# EAGLE schematic UNO florist automata V1.0 (EAGLE 9.1.3)
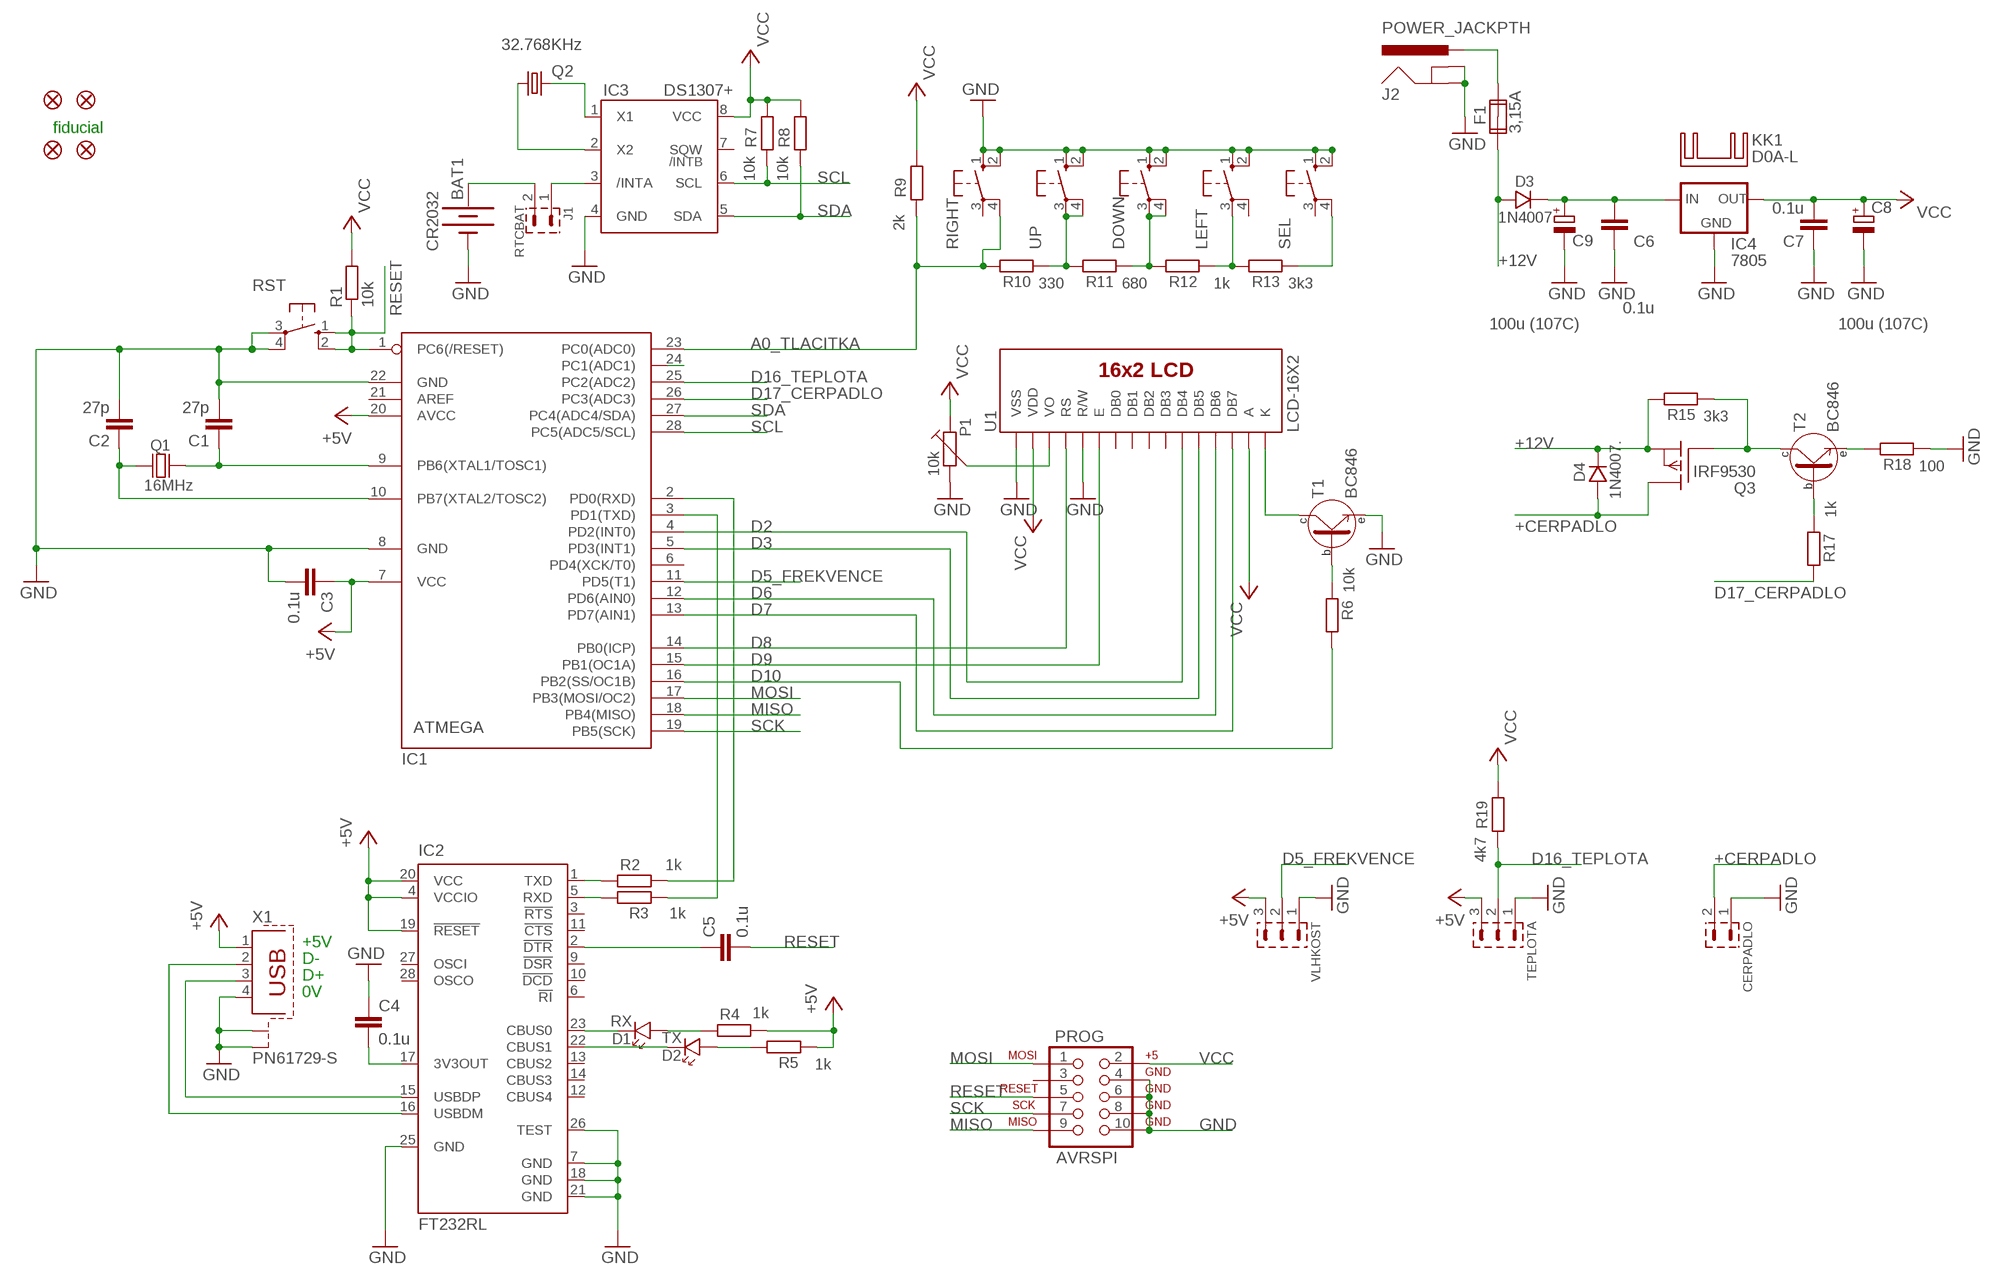
[diagram p0: schematic, sheet 1]

## Parts
BAT1  CR2032  BATTERY20PTH  [BATTCOM_20MM_PTH]
C1  27p  C-EUC1206  [C1206]
C2  27p  C-EUC1206  [C1206]
C3  0.1u  C-EUC1206  [C1206]
C4  0.1u  C-EUC1206  [C1206]
C5  0.1u  C-EUC1206  [C1206]
C6  0.1u  C-EUC1206  [C1206]
C7  0.1u  C-EUC1206  [C1206]
C8  100u (107C)  CPOL-EUC/6032-28W  [C/6032-28W]
C9  100u (107C)  CPOL-EUC/6032-28W  [C/6032-28W]
CERPADLO  PSH02-02P  [PSH02-02P]
D1  RX  LED_1206  [P1206]
D2  TX  LED_1206  [P1206]
D3  1N4007.  [SM-1]
D4  1N4007.  [SM-1]
DOWN  10-XX  [B3F-10XX]
F1  3,15A  FUSE2P  [FUSE1]
FID1  FIDUCIAL1.5X3  [FIDUCIAL-1.5X3]
FID2  FIDUCIAL1.5X3  [FIDUCIAL-1.5X3]
FID3  FIDUCIAL1.5X3  [FIDUCIAL-1.5X3]
FID4  FIDUCIAL1.5X3  [FIDUCIAL-1.5X3]
IC1  ATMEGA  MEGA8-P  [DIL28-3]
IC2  FT232RL  [SSOP28]
IC3  DS1307+  DS1337S+  [SO08]
IC4  7805  78XXL  [78XXL]
J1  RTCBAT  S1G2_JUMP  [S1G2_JUM]
J2  POWER_JACKPTH  [POWER_JACK_PTH]
KK1  D0A-L  [D02A-L]
LEFT  10-XX  [B3F-10XX]
P1  10k  TRIMRPT10V  [PT10V]
PROG  AVRSPI  AVR_SPI_PROG2LOCK  [2X5-SHROUDED_LOCK]
Q1  16MHz  Q_HC-49U  [HC-49U]
Q2  32.768KHz  CRYSTALTC38H  [TC38H]
Q3  IRF9530  [TO220]
R1  10k  R-EU_M1206  [M1206]
R2  1k  R-EU_M1206  [M1206]
R3  1k  R-EU_M1206  [M1206]
R4  1k  R-EU_M1206  [M1206]
R5  1k  R-EU_M1206  [M1206]
R6  10k  R-EU_M1206  [M1206]
R7  10k  R-EU_M1206  [M1206]
R8  10k  R-EU_M1206  [M1206]
R9  2k  R-EU_M1206  [M1206]
R10  330  R-EU_M1206  [M1206]
R11  680  R-EU_M1206  [M1206]
R12  1k  R-EU_M1206  [M1206]
R13  3k3  R-EU_M1206  [M1206]
R15  3k3  R-EU_M1206  [M1206]
R17  1k  R-EU_M1206  [M1206]
R18  100  R-EU_M1206  [M1206]
R19  4k7  R-EU_M1206  [M1206]
RIGHT  10-XX  [B3F-10XX]
RST  10-XX  [B3F-10XX]
SEL  10-XX  [B3F-10XX]
T1  BC846  [SOT-23]
T2  BC846  [SOT-23]
TEPLOTA  PSH02-03P  [PSH02-03P]
U1  LCD-16X2  LCD-16X2NOSILK  [LCD-16X2_NOSILK]
UP  10-XX  [B3F-10XX]
VLHKOST  PSH02-03P  [PSH02-03P]
X1  PN61729-S  [PN61729-S]

## Nets
+12V: D3.A D4.K F1.1A Q3.3(S) R15.2
+CERPADLO: CERPADLO.2 D4.A Q3.2(D)
A: IC3.2(X2) Q2.1
A0_TLACITKA: IC1.23(PC0(ADC0)) R9.1 R10.2 RIGHT.4(P1)
A1_OSVETLENI: IC1.24(PC1(ADC1))
D2: IC1.4(PD2(INT0)) U1.11(DB4)
D3: IC1.5(PD3(INT1)) U1.12(DB5)
D5_FREKVENCE: IC1.11(PD5(T1)) VLHKOST.2
D6: IC1.12(PD6(AIN0)) U1.13(DB6)
D7: IC1.13(PD7(AIN1)) U1.14(DB7)
D8: IC1.14(PB0(ICP)) U1.4(RS)
D9: IC1.15(PB1(OC1A)) U1.6(E)
D10: IC1.16(PB2(SS/OC1B)) R6.2
D16_TEPLOTA: IC1.25(PC2(ADC2)) R19.1 TEPLOTA.2
D17_CERPADLO: IC1.26(PC3(ADC3)) R17.2
GND: BAT1.2(-) C1.2 C2.2 C3.2 C4.1 C6.1 C7.1 C8.- C9.- CERPADLO.1 DOWN.1(S) DOWN.2(S1) IC1.8(GND) IC1.22(GND) IC2.7(GND) IC2.18(GND) IC2.21(GND) IC2.25(GND) IC2.26(TEST) IC3.4(GND) IC4.GND J2.GND J2.GNDBREAK LEFT.1(S) LEFT.2(S1) P1.2 PROG.4 PROG.6 PROG.8 PROG.10 R18.1 RIGHT.1(S) RIGHT.2(S1) RST.3(P) RST.4(P1) SEL.1(S) SEL.2(S1) T1.2(E) TEPLOTA.1 U1.1(VSS) U1.5(R/W) UP.1(S) UP.2(S1) VLHKOST.1 X1.4 X1.S1 X1.S2
MISO: IC1.18(PB4(MISO)) PROG.9
MOSI: IC1.17(PB3(MOSI/OC2)) PROG.1
N$1: IC2.16(USBDM) X1.2
N$2: IC2.15(USBDP) X1.3
N$3: C4.2 IC2.17(3V3OUT)
N$4: IC2.1(TXD) R2.1
N$5: IC2.5(RXD) R3.2
N$6: IC1.2(PD0(RXD)) R2.2
N$7: IC1.3(PD1(TXD)) R3.1
N$8: C5.1 IC2.2(!DTR)
N$9: D1.K IC2.23(CBUS0)
N$10: D1.A R4.1
N$11: D2.K IC2.22(CBUS1)
N$12: D2.A R5.2
N$13: BAT1.1(+) J1.2
N$14: IC3.3(/INTA) J1.1
N$15: T1.3(C) U1.16(K)
N$18: R10.1 R11.2 UP.3(P) UP.4(P1)
N$19: DOWN.3(P) DOWN.4(P1) R11.1 R12.2
N$20: LEFT.3(P) R12.1 R13.2
N$21: R13.1 SEL.4(P1)
N$22: F1.2A J2.PWR
N$23: C1.1 IC1.9(PB6(XTAL1/TOSC1)) Q1.2
N$24: C6.2 C9.+ D3.K IC4.IN
N$25: R6.1 T1.1(B)
N$26: C2.1 IC1.10(PB7(XTAL2/TOSC2)) Q1.1
N$27: Q3.1(G) R15.1 T2.3(C)
N$28: R18.2 T2.2(E)
N$29: R17.1 T2.1(B)
N$31: P1.3 U1.3(VO)
Q1: IC3.1(X1) Q2.2
RESET: C5.2 IC1.1(PC6(/RESET)) PROG.5 R1.1 RST.1(S) RST.2(S1)
SCK: IC1.19(PB5(SCK)) PROG.7
SCL: IC1.28(PC5(ADC5/SCL)) IC3.6(SCL) R7.1
SDA: IC1.27(PC4(ADC4/SDA)) IC3.5(SDA) R8.1
VCC: C3.1 C7.2 C8.+ IC1.7(VCC) IC1.20(AVCC) IC2.4(VCCIO) IC2.19(!RESET) IC2.20(VCC) IC3.8(VCC) IC4.OUT P1.1 PROG.2 R1.2 R4.2 R5.1 R7.2 R8.2 R9.2 R19.2 TEPLOTA.3 U1.2(VDD) U1.15(A) VLHKOST.3 X1.1 ; supply symbol labelled +5V
Unconnected: F1.1B F1.2B IC1.6(PD4(XCK/T0)) IC1.21(AREF) IC2.3(!RTS) IC2.6(!RI) IC2.9(!DSR) IC2.10(!DCD) IC2.11(!CTS) IC2.12(CBUS4) IC2.13(CBUS2) IC2.14(CBUS3) IC2.27(OSCI) IC2.28(OSCO) IC3.7(SQW) LEFT.4(P1) PROG.3 RIGHT.3(P) SEL.3(P) U1.7(DB0) U1.8(DB1) U1.9(DB2) U1.10(DB3)

## Notes on the sheet
- fiducial
- +5V
- D-
- D+
- 0V

## Library data of the parts
BAT1 = SparkFun-Electromechanical:BATTERY: Battery Holders Various common sizes : AA, AAA, 18650 (PRT-12895), 20mm coin cell and 12mm coin cell. 20MM_4LEGS, BATT-10373
C1-C7 = rcl:C-EU: CAPACITOR, European symbol
C8 C9 = rcl:CPOL-EU: POLARIZED CAPACITOR, European symbol
CERPADLO = #PaJa_konektory:PSH02-02: Konektory se zamkem - vidlice - 2pin
D1 D2 = #PaJa_31:LED: LED - jednobarevna
D3 D4 = #PaJa_31:1N4007: Usmernovaci dioda - 1A, 1000V
DOWN LEFT RIGHT RST SEL UP = switch-omron-modified:10-XX: OMRON SWITCH
F1 = special:FUSE2P: FUSE 5 x 20 mm
FID1-FID4 = SparkFun-Retired:FIDUCIAL: Fiducial Alignment Points Various fiducial points for machine vision alignment.
IC1 = atmel:MEGA8-P: MICROCONTROLLER 8 Kbytes FLASH, 1 kbytes SRAM, 512 bytes EEPROM, USART, 4-channel 10 bit ADC, 2-channel 8 bit ADC Pin compatible with Atmega48, ATMega88, ATMega168 Source: avr.lbr
IC2 = ftdichip:FT232R: Source: http://www.ftdichip.com/Documents/DataSheets/DS_FT232R_v104.pdf; MPN: FT232RL; OC_FARNELL: 1146032; OC_NEWARK: 91K9918
IC3 = #PaJa_31:DS1337: RTC - obvod realneho casu (ekviv. DS1307)
IC4 = v-reg:78XXL: VOLTAGE REGULATOR
J1 = #PaJa_konektory:S1G2_JUMP: Radove konektory - koliky - 2x
J2 = SparkFun-Connectors:POWER_JACK: Power Jack This is the standard 5.5mm barrel jack for power. The PTH is the most common, proven, reliable, footprint. The Slot footprint only works if the mill layer is transmitted to the PCB fab house so be warned. Mating wall wart : TOL-00298 (and others); PROD_ID: PRT-00119
KK1 = heatsink:D0A-L: HEATSINK distributor Schukat
P1 = #PaJa_31:TRIMR: Trimr
PROG = SparkFun-Connectors:AVR_SPI_PROG2: AVR 10-pin ICSP Header This is the standard AVR In Circuit Serial Programming header. Minimal, but includes pin one indicator. Works with standard Olimex programmers. Also look for the 6-pin reduced version. Spark Fun Electronics SKU: PRT-00778
Q1 = #PaJa_31:Q: Krystal HC-49 - 1MHz - 48MHz DT38 - Quartz (hodinovy) 32,768kHz
Q2 = crystal:CRYSTAL: CRYSTAL; OC_FARNELL: unknown; OC_NEWARK: unknown
Q3 = transistor-fet:IRF9530: P-Channel Enhancement MOSFET (HEXFET); -100V; -12A; 0,3Ohm
R1-R13 R15 R17-R19 = rcl:R-EU_: RESISTOR, European symbol
T1 T2 = #PaJa_31:BC846: SMD tranzistor - NPN - ekv. BC546
TEPLOTA VLHKOST = #PaJa_konektory:PSH02-03: Konektory se zamkem - vidlice - 3pin
U1 = SparkFun-Displays:LCD-16X2: Standard text-only 16x2 parallel input LCD
X1 = con-berg:PN61729-S: BERG USB connector; OC_FARNELL: unknown; OC_NEWARK: unknown